# EAGLE design autopilot (EAGLE 9.6.2)
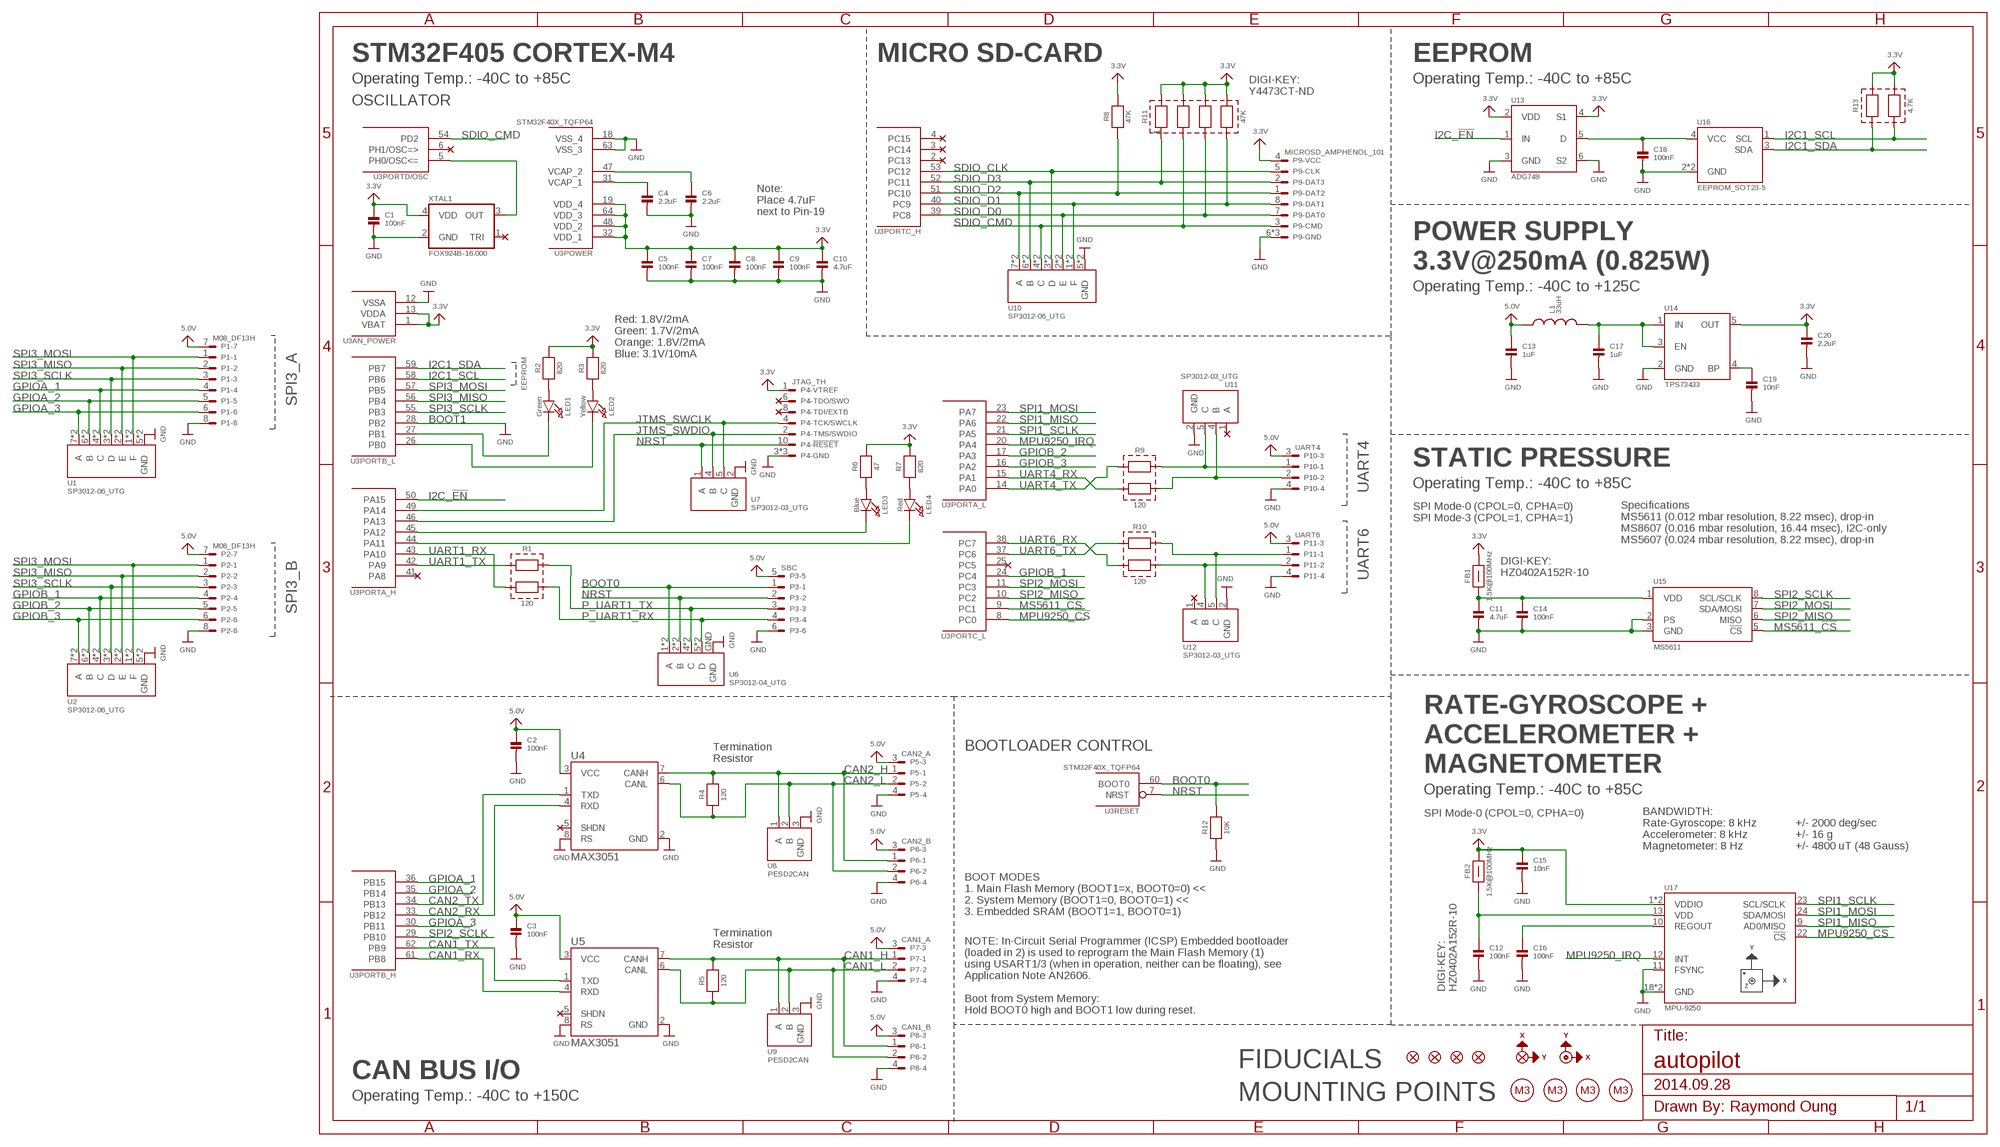
[diagram p0: schematic, sheet 1]

## Parts
AXIS3D1  AXIS3D_DOWN  [AXIS3D_DOWN]
AXIS3D2  AXIS3D_UP  [AXIS3D_UP]
C1  100nF  CAP_CERAMIC0402  [0402]
C2  100nF  CAP_CERAMIC0402  [0402]
C3  100nF  CAP_CERAMIC0402  [0402]
C4  2.2uF  CAP_CERAMIC0402  [0402]
C5  100nF  CAP_CERAMIC0402  [0402]
C6  2.2uF  CAP_CERAMIC0402  [0402]
C7  100nF  CAP_CERAMIC0402  [0402]
C8  100nF  CAP_CERAMIC0402  [0402]
C9  100nF  CAP_CERAMIC0402  [0402]
C10  4.7uF  CAP_CERAMIC0402  [0402]
C11  4.7uF  CAP_CERAMIC0402  [0402]
C12  100nF  CAP_CERAMIC0402  [0402]
C13  1uF  CAP_CERAMIC0402  [0402]
C14  100nF  CAP_CERAMIC0402  [0402]
C15  10nF  CAP_CERAMIC0402  [0402]
C16  100nF  CAP_CERAMIC0402  [0402]
C17  1uF  CAP_CERAMIC0402  [0402]
C18  100nF  CAP_CERAMIC0402  [0402]
C19  10nF  CAP_CERAMIC0402  [0402]
C20  2.2uF  CAP_CERAMIC0402  [0402]
FB1  1.5K@100MHz  FERRITE_0402  [0402]
FB2  1.5K@100MHz  FERRITE_0402  [0402]
L1  33uH  INDUCTOR_1210  [1210]
LED1  Green  LED_0603  [CHIPLED_0603]
LED2  Yellow  LED_0603  [CHIPLED_0603]
LED3  Blue  LED_0603  [CHIPLED_0603]
LED4  Red  LED_0603  [CHIPLED_0603]
MP1  M3  [MP_M3]
MP2  M3  [MP_M3]
MP3  M3  [MP_M3]
MP4  M3  [MP_M3]
P1  M08_DF13H  [DF13A-8P-1.25H]
P2  M08_DF13H  [DF13A-8P-1.25H]
P3  SBC  M06_DF13H  [DF13A-6P-1.25H]
P4  JTAG_TH  [FTSH-105-01-XXX-DV]
P5  CAN2_A  M04_DF13H  [DF13A-4P-1.25H]
P6  CAN2_B  M04_DF13H  [DF13A-4P-1.25H]
P7  CAN1_A  M04_DF13H  [DF13A-4P-1.25H]
P8  CAN1_B  M04_DF13H  [DF13A-4P-1.25H]
P9  MICROSD_AMPHENOL_101  [AMPHENOL_101-00660-68]
P10  UART4  M04_DF13H  [DF13A-4P-1.25H]
P11  UART6  M04_DF13H  [DF13A-4P-1.25H]
R1  120  RESISTOR2_0603X2  [EXBV4V]
R2  820  RESISTOR0402  [0402]
R3  820  RESISTOR0402  [0402]
R4  120  RESISTOR0603  [0603]
R5  120  RESISTOR0603  [0603]
R6  47  RESISTOR0402  [0402]
R7  820  RESISTOR0402  [0402]
R8  47K  RESISTOR0603  [0603]
R9  120  RESISTOR2_0603X2  [EXBV4V]
R10  120  RESISTOR2_0603X2  [EXBV4V]
R11  47K  RESISTOR4_0603X4  [EXBV8V]
R12  10K  RESISTOR0402  [0402]
R13  4.7K  RESISTOR2_0603X2  [EXBV4V]
REF1  FIDUCIAL1X2.5  [POINT-1MM]
REF2  FIDUCIAL1X2.5  [POINT-1MM]
REF3  FIDUCIAL1X2.5  [POINT-1MM]
REF4  FIDUCIAL1X2.5  [POINT-1MM]
U1  SP3012-06_UTG  [UDFN14]
U2  SP3012-06_UTG  [UDFN14]
U3  STM32F40X_TQFP64  [TQFP64]
U4  MAX3051  [SOT23-8]
U5  MAX3051  [SOT23-8]
U6  SP3012-04_UTG  [UDFN10]
U7  SP3012-03_UTG  [UDFN06]
U8  PESD2CAN  [SOT23-3]
U9  PESD2CAN  [SOT23-3]
U10  SP3012-06_UTG  [UDFN14]
U11  SP3012-03_UTG  [UDFN06]
U12  SP3012-03_UTG  [UDFN06]
U13  ADG749  [SOT-363]
U14  TPS73433  [SOT23-5]
U15  MS5611  [MS5611]
U16  EEPROM_SOT23-5  [SOT23-5]
U17  MPU-9250  [MPU-3X3]
XTAL1  FOX924B-16.000  TCXO_5.0X3.2A  [OSCILLATOR-5.0X3.2A]

## Nets
3.3V [PWR]: C1.1 C5.1 C7.1 C8.1 C9.1 C10.1 C15.1 C20.1 FB1.2 FB2.2 P4.1 P9.4 R2.2 R3.2 R6.2 R7.2 R8.2 R11.5 R11.6 R11.7 R11.8 R13.3 R13.4 U3.1(AN_POWER:VBAT) U3.13(AN_POWER:VDDA) U3.19(POWER:VDD_4) U3.32(POWER:VDD_1) U3.48(POWER:VDD_2) U3.64(POWER:VDD_3) U13.2(VDD) U13.4(S1) U14.5(OUT) U17.1(VDDIO) U17.8(VDDIO) XTAL1.4(VDD)
5.0V [PWR]: C2.1 C3.1 C13.1 L1.1 P1.7 P2.7 P3.5 P5.3 P6.3 P7.3 P8.3 P10.3 P11.3 U4.3(VCC) U5.3(VCC)
BOOT0 [PWR]: P3.1 R12.2 U3.60(RESET:BOOT0) U6.1(A) U6.10(A)
CAN1_H: P7.1 P8.1 R5.2 U5.7(CANH) U9.1(A)
CAN1_L: P7.2 P8.2 R5.1 U5.6(CANL) U9.2(B)
CAN1_RX: U3.61(PORTB_H:PB8) U5.4(RXD)
CAN1_TX: U3.62(PORTB_H:PB9) U5.1(TXD)
CAN2_H: P5.1 P6.1 R4.2 U4.7(CANH) U8.1(A)
CAN2_L: P5.2 P6.2 R4.1 U4.6(CANL) U8.2(B)
CAN2_RX: U3.33(PORTB_H:PB12) U4.4(RXD)
CAN2_TX: U3.34(PORTB_H:PB13) U4.1(TXD)
GND [PWR]: C1.2 C2.2 C3.2 C4.2 C5.2 C6.2 C7.2 C8.2 C9.2 C10.2 C11.2 C12.2 C13.2 C14.2 C15.2 C16.2 C17.2 C18.2 C19.2 C20.2 P1.8 P2.8 P3.6 P4.3 P4.5 P4.9 P5.4 P6.4 P7.4 P8.4 P9.6 P9.GND1 P9.GND3 P10.4 P11.4 R12.1 U1.5(GND) U1.10(GND) U2.5(GND) U2.10(GND) U3.12(AN_POWER:VSSA) U3.18(POWER:VSS_4) U3.28(PORTB_L:PB2) U3.63(POWER:VSS_3) U4.2(GND) U4.8(RS) U5.2(GND) U5.8(RS) U6.GND U7.2(GND) U8.3(GND) U9.3(GND) U10.5(GND) U10.10(GND) U11.2(GND) U12.2(GND) U13.3(GND) U13.6(S2) U14.2(GND) U15.2(PS) U15.3(GND) U16.2(GND) U16.5(GND) U17.11(FSYNC) U17.18(GND) U17.20(GND) XTAL1.2(GND)
GPIOA_1: P1.4 U1.4(C) U1.11(C) U3.36(PORTB_H:PB15)
GPIOA_2: P1.5 U1.6(B) U1.9(B) U3.35(PORTB_H:PB14)
GPIOA_3: P1.6 U1.7(A) U1.8(A) U3.30(PORTB_H:PB11)
GPIOB_1: P2.4 U2.4(C) U2.11(C) U3.24(PORTC_L:PC4)
GPIOB_2: P2.5 U2.6(B) U2.9(B) U3.17(PORTA_L:PA3)
GPIOB_3: P2.6 U2.7(A) U2.8(A) U3.16(PORTA_L:PA2)
I2C1_SCL: R13.2 U3.58(PORTB_L:PB6) U16.1(SCL)
I2C1_SDA: R13.1 U3.59(PORTB_L:PB7) U16.3(SDA)
I2C_!EN: U3.50(PORTA_H:PA15) U13.1(IN)
JTMS_SWCLK: P4.4 U3.49(PORTA_H:PA14) U7.5(C)
JTMS_SWDIO: P4.2 U3.46(PORTA_H:PA13) U7.4(B)
MPU9250_!CS: U3.8(PORTC_L:PC0) U17.22(!CS)
MPU9250_IRQ: U3.20(PORTA_L:PA4) U17.12(INT)
MS5611_!CS: U3.9(PORTC_L:PC1) U15.5(!CS)
N$1: LED4.A R7.1
N$2: LED1.A R2.1
N$3: LED2.A R3.1
N$4: C16.1 U17.10(REGOUT)
N$5: LED3.A R6.1
N$6: C12.1 FB2.1 U17.13(VDD)
N$7: LED3.C U3.45(PORTA_H:PA12)
N$8: U3.5(PORTD/OSC:PH0/OSC<=) XTAL1.3(OUT)
N$9 [PWR]: C18.1 U13.5(D) U16.4(VCC)
N$11: C19.1 U14.4(BP)
N$12: LED4.C U3.44(PORTA_H:PA11)
N$13: LED1.C U3.27(PORTB_L:PB1)
N$14: LED2.C U3.26(PORTB_L:PB0)
N$18: C17.1 L1.2 U14.1(IN) U14.3(EN)
NRST: P3.2 P4.10 U3.7(RESET:NRST) U6.2(B) U6.9(B) U7.1(A)
P_UART1_RX: P3.4 R1.3 U6.5(D) U6.6(D)
P_UART1_TX: P3.3 R1.4 U6.4(C) U6.7(C)
P_UART4_RX: P10.2 R9.3 U11.4(B)
P_UART4_TX: P10.1 R9.4 U11.5(C)
P_UART6_RX: P11.2 R10.3 U12.4(B)
P_UART6_TX: P11.1 R10.4 U12.5(C)
SDIO_CLK: P9.5 U3.53(PORTC_H:PC12) U10.3(D) U10.12(D)
SDIO_CMD: P9.3 R11.2 U3.54(PORTD/OSC:PD2) U10.4(C) U10.11(C)
SDIO_D0: P9.7 R11.3 U3.39(PORTC_H:PC8) U10.2(E) U10.13(E)
SDIO_D1: P9.8 R11.4 U3.40(PORTC_H:PC9) U10.1(F) U10.14(F)
SDIO_D2: P9.1 R8.1 U3.51(PORTC_H:PC10) U10.7(A) U10.8(A)
SDIO_D3: P9.2 R11.1 U3.52(PORTC_H:PC11) U10.6(B) U10.9(B)
SPI1_MISO: U3.22(PORTA_L:PA6) U17.9(AD0/MISO)
SPI1_MOSI: U3.23(PORTA_L:PA7) U17.24(SDA/MOSI)
SPI1_SCLK: U3.21(PORTA_L:PA5) U17.23(SCL/SCLK)
SPI2_MISO: U3.10(PORTC_L:PC2) U15.6(MISO)
SPI2_MOSI: U3.11(PORTC_L:PC3) U15.7(SDA/MOSI)
SPI2_SCLK: U3.29(PORTB_H:PB10) U15.8(SCL/SCLK)
SPI3_MISO: P1.2 P2.2 U1.2(E) U1.13(E) U2.2(E) U2.13(E) U3.56(PORTB_L:PB4)
SPI3_MOSI: P1.1 P2.1 U1.1(F) U1.14(F) U2.1(F) U2.14(F) U3.57(PORTB_L:PB5)
SPI3_SCLK: P1.3 P2.3 U1.3(D) U1.12(D) U2.3(D) U2.12(D) U3.55(PORTB_L:PB3)
UART1_RX: R1.2 U3.43(PORTA_H:PA10)
UART1_TX: R1.1 U3.42(PORTA_H:PA9)
UART4_RX: R9.2 U3.15(PORTA_L:PA1)
UART4_TX: R9.1 U3.14(PORTA_L:PA0)
UART6_RX: R10.2 U3.38(PORTC_L:PC7)
UART6_TX: R10.1 U3.37(PORTC_L:PC6)
VCAP_1 [PWR]: C4.1 U3.31(POWER:VCAP_1)
VCAP_2 [PWR]: C6.1 U3.47(POWER:VCAP_2)
VDD_PRES: C11.1 C14.1 FB1.1 U15.1(VDD)
Unconnected: P4.6 P4.8 U3.2(PORTC_H:PC13) U3.3(PORTC_H:PC14) U3.4(PORTC_H:PC15) U3.6(PORTD/OSC:PH1/OSC=>) U3.25(PORTC_L:PC5) U3.41(PORTA_H:PA8) U4.5(SHDN) U5.5(SHDN) U11.1(A) U12.1(A) XTAL1.1(TRI)

## Notes on the sheet
- STM32F405 CORTEX-M4 | MICRO SD-CARD | EEPROM
- Operating Temp.: -40C to +85C | Operating Temp.: -40C to +85C
- DIGI-KEY:
  Y4473CT-ND
- OSCILLATOR
- Note: 
  Place 4.7uF 
  next to Pin-19
- POWER SUPPLY
  3.3V@250mA (0.825W)
- Operating Temp.: -40C to +125C
- Red: 1.8V/2mA
  Green: 1.7V/2mA
  Orange: 1.8V/2mA
  Blue: 3.1V/10mA
- EEPROM
- SPI3_A
- BOOT1
- UART4 | STATIC PRESSURE
- Operating Temp.: -40C to +85C
- SPI Mode-0 (CPOL=0, CPHA=0)
  SPI Mode-3 (CPOL=1, CPHA=1)
- Specifications
  MS5611 (0.012 mbar resolution, 8.22 msec), drop-in
  MS8607 (0.016 mbar resolution, 16.44 msec), I2C-only
  MS5607 (0.024 mbar resolution, 8.22 msec), drop-in
- UART6
- DIGI-KEY: 
  HZ0402A152R-10
- SPI3_B
- BOOTLOADER CONTROL
- Termination
  Resistor
- RATE-GYROSCOPE + 
  ACCELEROMETER + 
  MAGNETOMETER
- Operating Temp.: -40C to +85C
- SPI Mode-0 (CPOL=0, CPHA=0)
- BANDWIDTH:
  Rate-Gyroscope: 8 kHz
  Accelerometer: 8 kHz
  Magnetometer: 8 Hz
- +/- 2000 deg/sec
  +/- 16 g
  +/- 4800 uT (48 Gauss)
- BOOT MODES
  1. Main Flash Memory (BOOT1=x, BOOT0=0) <<
  2. System Memory (BOOT1=0, BOOT0=1) <<
  3. Embedded SRAM (BOOT1=1, BOOT0=1)
- Termination
  Resistor
- DIGI-KEY: 
  HZ0402A152R-10
- NOTE: In-Circuit Serial Programmer (ICSP) Embedded bootloader
  (loaded in 2) is used to reprogram the Main Flash Memory (1) 
  using USART1/3 (when in operation, neither can be floating), see
  Application Note AN2606.
  
  Boot from System Memory:
  Hold BOOT0 high and BOOT1 low during reset.
- FIDUCIALS
- CAN BUS I/O
- 2014.09.28
- Operating Temp.: -40C to +150C | MOUNTING POINTS

## Library data of the parts
AXIS3D1 = custom-artwork:AXIS3D_DOWN
AXIS3D2 = custom-artwork:AXIS3D_UP: 3D Axes
C1-C20 = custom-generic:CAP_CERAMIC: Ceramic Capacitor 0402 - 0402 Surface Mount Capacitors 16pF 50V 5% [Digikey: 445-4899-2-ND] 18pF 50V 5% [Digikey: 490-1281-2-ND] 22pF 50V 5% [Digikey: 490-1283-2-ND] 68pF 50V 5% [Digikey: 490-1289-2-ND] 0.1uF 10V 10% [Digikey: 490-1318-2-ND] 1.0uF 6.3V 10% [Digikey: 490-1320-2-ND] 0603 - 0603 Surface Mount Capacitors 16 pF 50V 5% [Digikey: 445-5051-2-ND] 22 pF 50V [Digikey: PCC220ACVTR-ND] 33 pF 50V 5% [Digikey: 490-1415-1-ND] 56pF 50V 5% [Digikey: 490-1421-1-ND] 220pF 50V 5% [Digikey: 445-1285-1-ND] 680 pF 50V 2200 pF 50V 5% C0G [Digikey: 445-1297-1-ND] 5600 pF 100V 5% X7R [Digikey: 478-3711-1-ND] 0.1 µF 25V 10% [Digikey: PCC2277TR-ND] 0.22 µF 16V 10% X7R [Digikey: 445-1318-1-ND] 1.0 µF 25V 10% [Digikey: 445-5146-2-ND] 0603 - RF Specific 3pF 250V +/-0.1pF RF [Digikey: 712-1347-1-ND] 18 pF 250V 5% [Digikey: 478-3505-1-ND or 712-1322-1-ND] 56 pF 250V 5% C0G RF [Digikey: 490-4867-1-ND] 68 pF 250V RF [Digikey: 490-4868-1-ND] 0805 - 0805 Surface Mount Capacitors 220 pF 250V 2% RF Ceramic Capacitor [Digikey: 712-1398-1-ND] 1000 pF 50V 2% NP0 Ceramic Capacitor [Digikey: 478-3760-1-ND] 0.1 µF 25V 10% Ceramic Capacitor [Digikey: PCC1828TR-ND] 1.0 µF 16V 10% Ceramic Capacitor[Digikey: 490-1691-2-ND] 10.0 µF 10V 10% Ceramic Capacitor[Digikey: 709-1228-1-ND] 10.0 uF 16V 10% Ceramic Capacitor [Digikey: 478-5165-2-ND] 47 uF 6.3V 20% Ceramic Capacitor [Digikey: 587-1779-1-ND or 399-5506-1-ND] 1206 - 1206 Surface Mount Capacitors 47uF 10V 20% Ceramic Capacitor [Digikey: 490-5528-1-ND or 399-5508-1-ND or 445-6010-1-ND]
FB1 FB2 = custom-generic:FERRITE: Ferrite Bead
L1 = custom-generic:INDUCTOR: Inductors Basic Inductor/Choke - 0603 and 1206. Footprints are not proven and vary greatly between part numbers.
LED1-LED4 = custom-generic:LED: LED 0603 - 0603 Surface Mount Package 2mA: Blue LED - Low Power (39.2mcd, 10 mA, 3.1Vf) - DigiKey: 475-1383-1-ND Green LED - Low Power (3.9mcd, 2mA, 1.7Vf) - Digikey: 475-2709-1-ND Orange LED - Low Power (9.8mcd, 2mA, 1.8Vf) - Digikey: 475-1194-2-ND Red LED - Low Power (5mcd, 2mA, 1.8Vf) - Digikey: 475-2506-1-ND Yellow LED - Low Power (7mcd, 2mA, 1.8Vf) - Digikey: 475-1196-1-ND 5mA: Blue LED - Low Power (17mcd, 5ma, 2.9Vf) - Digikey: LNJ937W8CRACT-ND 0805 - 0805 Surface Mount Package 2mA: Red LED (8.8mcd, 2mA, 1.8Vf, Clear) - Low Power [Digikey: 475-2510-1-ND] Green LED (5mcd, 2mA, 1.8Vf, Clear) - Low Power [Digikey: 475-2730-1-ND] Yellow LED (11.3mcd, 2mA, 1.8Vf, Clear) - Low Power [Digikey: 475-2555-1-ND] 20mA: Red LED (104mcd, 20mA, Diffused) - LS R976 [Digikey: 475-1278-6-ND] Red LED (12mcd, 20mA, 2.0Vf, Clear) - APT2012EC [Digikey: 754-1128-1-ND] Green LED (15mcd, 20mA, 2.2Vf, Clear) - APT2012GC [Digikey: 754-1131-1-ND] Orange LED (160mcd, 20mA, 2.1Vf, Clear) - APT2012SECK [Digikey: 754-1130-1-ND] 1206 - 1206 Surface Mount Package Green LED (26mcd, 20mA, Diffused) - LG N971 [Digikey: 475-1407-6-ND] Red LED (15mcd, 20mA, Diffused) - LH N974 [Digikey: 475-1416-6-ND]
MP1-MP4 = custom-mechanical:M3: Mounting Point M3
P1 P2 = custom-connectors:M08: 8-Way Connector; DIGI-KEY: H3386-ND
P3 = custom-connectors:M06: 6-Way Connector; DIGI-KEY: H3371-ND; MOUSER: 798-DF13A6P125H20
P4 = custom-connectors:JTAG: JTAG Connector; DIGI-KEY: 952-1383-ND; MOUSER: 855-M50-3500542; TEMPERATURE: -40°C to 105°C
P5-P8 P10 P11 = custom-connectors:M04: 4-Way Connector; DIGI-KEY: H3369-ND; MOUSER: 798-DF13A4P125H20; TEMPERATURE: -35°C to +85°C
P9 = custom-connectors:MICROSD: SD Card; DIGI-KEY: 101-00660-68-6-1-ND; MOUSER: 523-101-00660-68-6
R1 R9 R10 R13 = custom-generic:RESISTOR2: 2x Isolated Resistor Network
R2-R8 R12 = custom-generic:RESISTOR: Resistors 0402 - 0402 Surface Mount Package 22 Ohm 1% 1/16W [Digikey: 311-22.0LRTR-ND] 33 Ohm 5% 1/16W 1.0K 5% 1/16W 1.5K 5% 1/16W 2.0K 1% 1/16W 10.0K 1% 1/16W [Digikey: 311-10.0KLRTR-ND] 10.0K 5% 1/16W [Digikey: RMCF0402JT10K0TR-ND] 12.1K 1% 1/16W [Digikey: 311-22.0LRTR-ND] 100.0K 5% 1/16W 0603 - 0603 Surface Mount Package 0 Ohm 1/10 Watt 1% Resistor 15 Ohm 1/10 Watt 1% Resistor 33 Ohm 1/10 Watt 1% Resistor 49.9 Ohm 1/10 Watt 1% Resistor 100 Ohm 1/10 Watt 1% Resistor 150 Ohm 1/10 Watt 1% Resistor 240 Ohm 1/10 Watt 1% Resistor 390 Ohm 1/10 Watt 1% Resistor 560 Ohm 1/10 Watt 1% Resistor 680 Ohm 1/10 Watt 1% Resistor 750 Ohm 1/10 Watt 1% Resistor 1.0K Ohm 1/10 Watt 1% Resistor 1.5K Ohm 1/10 Watt 1% Resistor 2.0K Ohm 1/10 Watt 1% Resistor 2.2K Ohm 1/10 Watt 1% Resistor 3.3K Ohm 1/10 Watt 1% Resistor 4.7K Ohm 1/10 Watt 1% Resistor 10.0K Ohm 1/10 Watt 1% Resistor 12.0K Ohm 1/10 Watt 1% Resistor 12.1K Ohm 1/10 Watt 1% Resistor 20.0K Ohm 1/10 Watt 1% Resistor 33.0K Ohm 1/10 Watt 1% Resistor 100.0K Ohm 1/10 Watt 1% Resistor 0805 - 0805 Surface Mount Package 0 Ohm 1/8 Watt 1% Resistor 33 Ohm 1/8 Watt 1% Resistor 100 Ohm 1/8 Watt 1% Resistor 150 Ohm 1/8 Watt 1% Resistor 200 Ohm 1/8 Watt 1% Resistor 240 Ohm 1/8 Watt 1% Resistor 330 Ohm 1/8 Watt 1% Resistor 390 Ohm 1/8 Watt 1% Resistor 470 Ohm 1/8 Watt 1% Resistor 1.0K Ohm 1/8 Watt 1% Resistor 1.5K Ohm 1/8 Watt 1% Resistor 2.0K Ohm 1/8 Watt 1% Resistor 4.7K Ohm 1/8 Watt 1% Resistor 5.1K Ohm 1/8 Watt 1% Resistor 5.6K Ohm 1/8 Watt 1% Resistor 10.0K Ohm 1/8 Watt 1% Resistor 22.0K Ohm 1/8 Watt 1% Resistor 33.0K Ohm 1/8 Watt 1% Resistor 100K Ohm 1/8 Watt 1% Resistor 1206 - 1206 Surface Mount Package 2012 - 2010 Surface Mount Package 0.11 Ohm 1/2 Watt 1% Resistor - Digikey: RHM.11UCT-ND
R11 = custom-generic:RESISTOR4: 4x Isolated Resistor Network
REF1-REF4 = custom-mechanical:FIDUCIAL: Fiducial Alignment Points Various fiducial points for machine vision alignment.
U1 U2 U10 = custom-devices:SP3012-06: TVS Diode Arrays 6-Ch 12KV 0.5pF; DIGI-KEY: F5914CT-ND; MOUSER: 576-SP3012-06UTG
U3 = custom-devices:STM32F40X_TQFP64: STM32F40x 64-pin LQFP; DIGI-KEY: 497-11767-ND; MOUSER: 511-STM32F405RGT6
U4 U5 = custom-devices:MAX3051: CAN Transceiver; DIGI-KEY: MAX3051EKA+TCT-ND; MOUSER: 700-MAX3051EKAT
U6 = custom-devices:SP3012-04: TVS Diode Arrays 4-Ch 12KV 0.5pF; DIGI-KEY: F4087CT-ND; MOUSER: 576-SP3012-04UTG
U7 U11 U12 = custom-devices:SP3012-03: TVS Diode Arrays 3-Ch 12KV 0.5pF; DIGI-KEY: F6292CT-ND; MOUSER: 576-SP3012-03UTG
U8 U9 = custom-devices:PESD2CAN: PESD2CAN in a small SOT23 Surface-Mounted Device (SMD) plastic package designed to protect two automotive Controller Area Network (CAN) bus lines from the damage caused by ElectroStatic Discharge (ESD) and other transients.; DIGI-KEY: 568-4147-1-ND; MOUSER: 771-PESD2CAN-T/R
U13 = custom-devices:ADG749: 2:1 Multiplexer; DIGI-KEY: ADG749BKSZ-REEL7CT-ND; MOUSER: 584-ADG749BKSZ-R7
U14 = custom-devices:TPS73433: 3.3V, 250mA, Low Quiescent Current, Ultra-Low Noise, High PSRR Low-Dropout Linear Regulator.; DIGI-KEY: 296-36844-1-ND; MOUSER: 595-TPS73433TDDCRQ1
U15 = custom-devices:MS5611: Pressure Sensor; FARNELL: 2362662; MOUSER: 824-MS561101BA03-50
U16 = custom-devices:EEPROM: I2C EEPROM 64Kbytes; DIGI-KEY: 24LC64T-I/OTCT-ND; MOUSER: 579-24LC64T-I/OT
U17 = custom-devices:MPU-9250: Nine-Axis (Gyro + Accelerometer + Compass) MEMS MotionTracking™ Device; DIGI-KEY: 1428-1019-1-ND
XTAL1 = custom-generic:TCXO: Temperature Compensated Crystal Oscillator

## Net classes
0 default: width 0.152 mm, drill 0.203 mm, clearance 0.152 mm
1 PWR: width 0.203 mm, drill 0.203 mm, clearance 0.152 mm

## Board
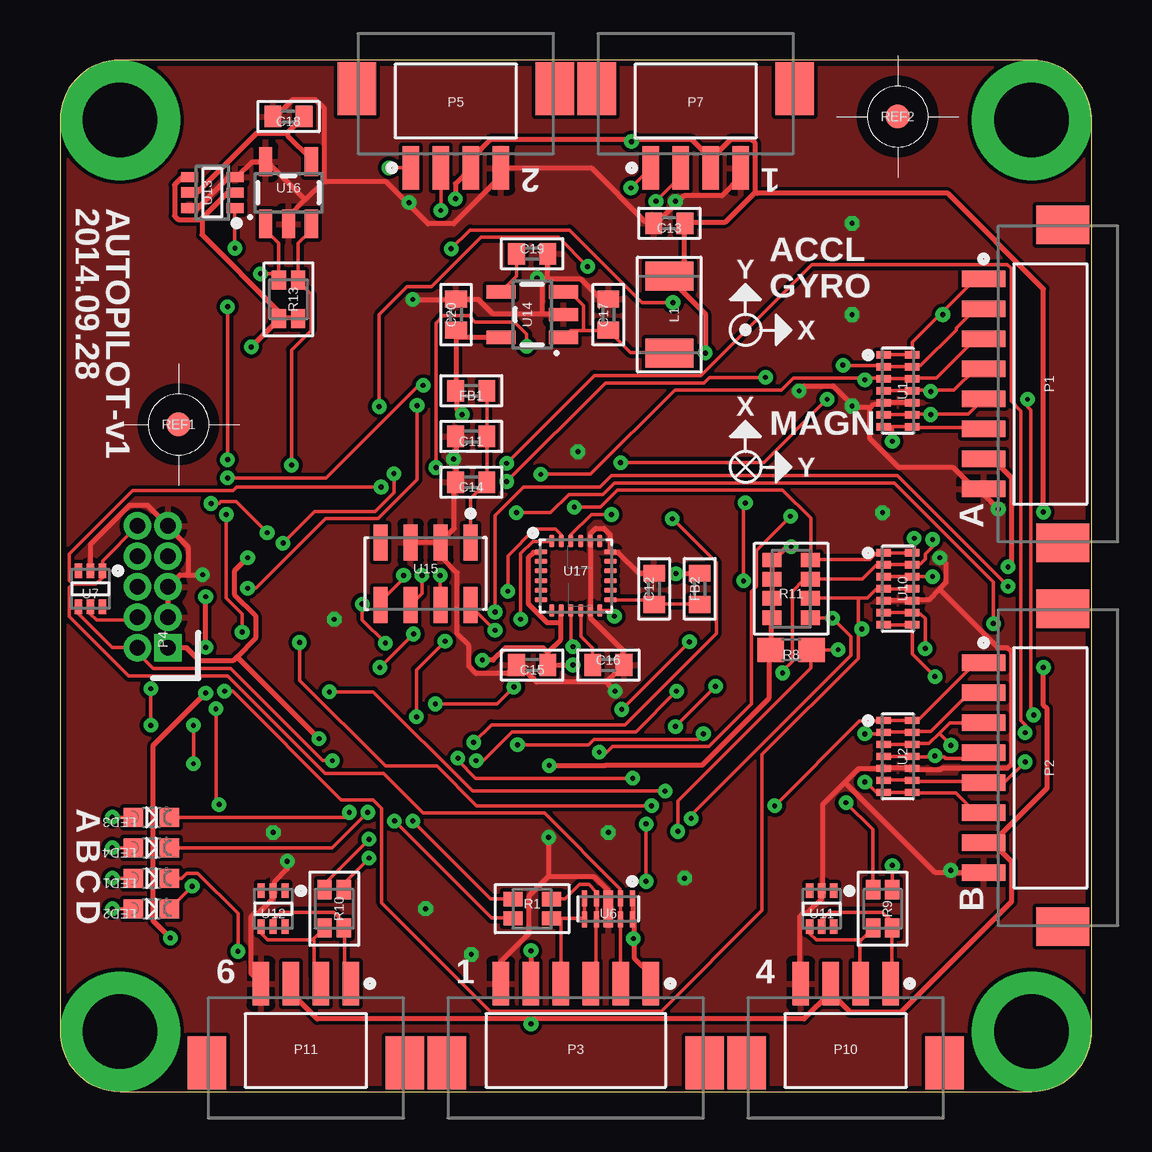
[diagram p1: board, top side]
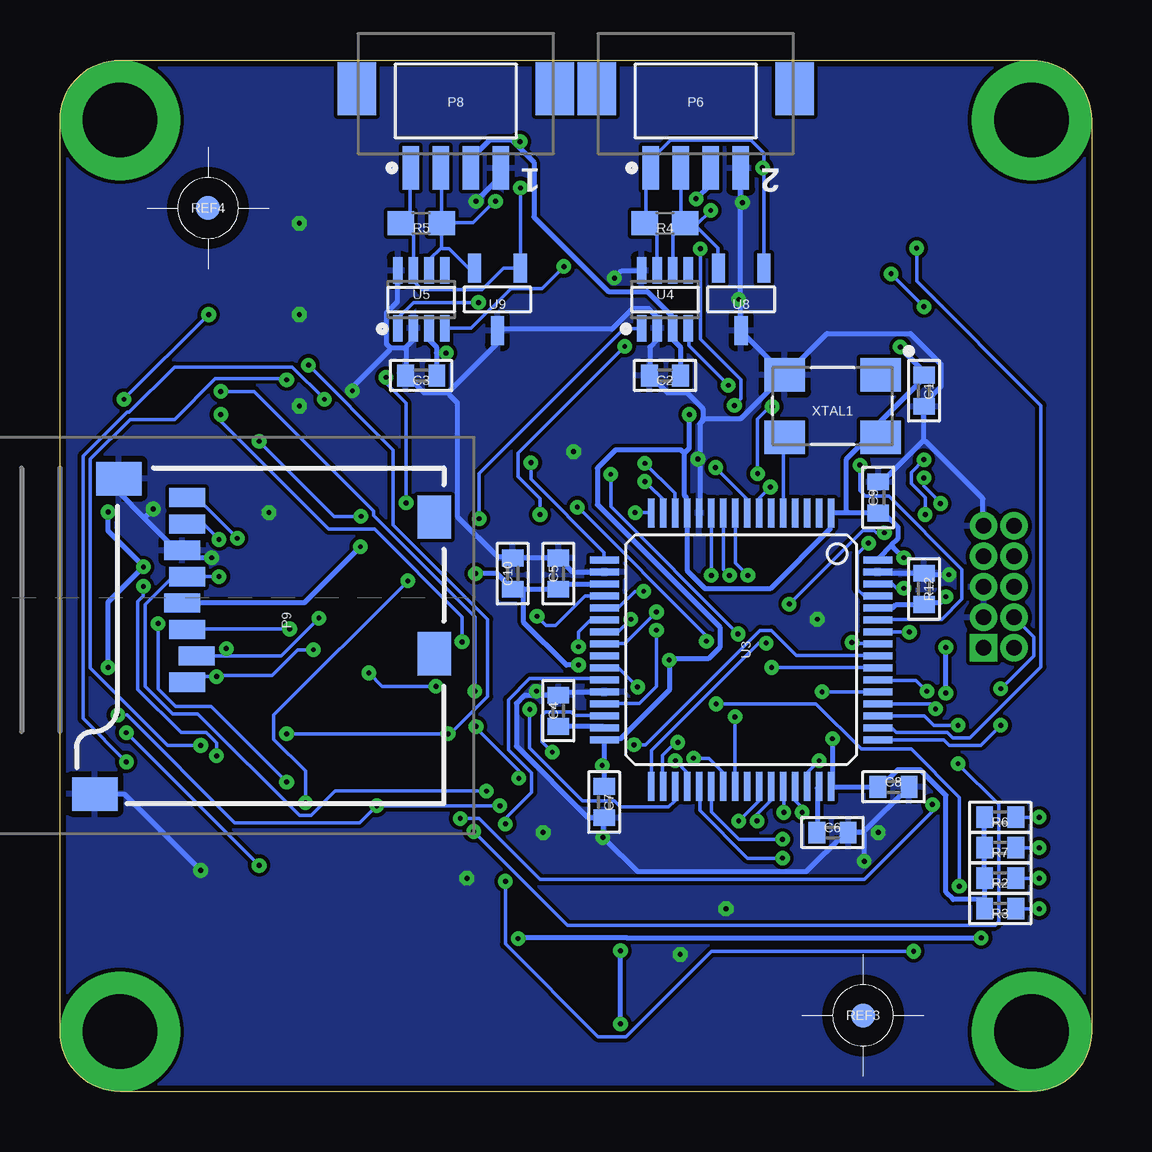
[diagram p2: board, bottom side, seen from below]

Size 43 x 43 mm. Coordinates in mm from the lower left corner, seen from the top.
Outline: 2.5,0 40.5,0 arc90 43,2.5 43,40.5 arc90 40.5,43 2.5,43 arc90 0,40.5 0,2.5 arc90 2.5,0
Copper layers (1*16): Top 0.035mm / dielectric 1.5mm / Bottom 0.035mm
Design rules "BetaLayout-2layer": minimum track width 6mil, minimum drill 8mil, track to track 6mil, track to pad 6mil, pad to pad 6mil, via to via 6mil, smd to smd 0mil, copper to edge 10mil, drill to drill 10mil, minimum pad ring 10mil, minimum via ring 8mil, stop-mask expansion 2mil, vias tented up to drill 100mil, thermal gap 10mil

### Footprints (pad centres in the part's own frame; a part is rotated, then mirrored left to right if it is on the bottom)
0402 = smd 0.7 x 0.9: 1 -0.65,0; 2 0.65,0
1210 = smd 1.2 x 2: 1 -1.6,0; 2 1.6,0
CHIPLED_0603 = smd 0.8 x 0.8: A 0,-0.75; C 0,0.75
MP_M3 = drill 3.1 pad 5: NC 0,0
DF13A-8P-1.25H = smd 0.7 x 1.8: 1 -4.375,0; 2 -3.125,0; 3 -1.875,0; 4 -0.625,0; 5 0.625,0; 6 1.875,0; 7 3.125,0; 8 4.375,0 | smd 1.6 x 2.2: NC1 -6.625,3.3; NC2 6.625,3.3
DF13A-6P-1.25H = smd 0.7 x 1.8: 1 -3.125,0; 2 -1.875,0; 3 -0.625,0; 4 0.625,0; 5 1.875,0; 6 3.125,0 | smd 1.6 x 2.2: NC1 -5.375,3.3; NC2 5.375,3.3
FTSH-105-01-XXX-DV = drill 0.65 pad 1 square: 1 0,0 | drill 0.65 pad 1: 2 0,1.27; 3 1.27,0; 4 1.27,1.27; 5 2.54,0; 6 2.54,1.27; 7 3.81,0; 8 3.81,1.27; 9 5.08,0; 10 5.08,1.27
DF13A-4P-1.25H = smd 0.7 x 1.8: 1 -1.875,0; 2 -0.625,0; 3 0.625,0; 4 1.875,0 | smd 1.6 x 2.2: NC1 -4.125,3.3; NC2 4.125,3.3
AMPHENOL_101-00660-68 = smd 0.8 x 1.5: 1 -8.94,10.7; 2 -7.84,10.3; 3 -6.74,10.7; 4 -5.64,10.9; 5 -4.54,10.7; 6 -3.44,10.9; 7 -2.34,10.7; 8 -1.24,10.7 | smd 1.8 x 1.4: CD1 -2.05,0.4; CD2 -7.75,0.4 | smd 1.4 x 1.9: GND1 -13.6,14.55; GND3 -0.45,13.55
EXBV4V = smd 0.8 x 0.6: 1 -0.8,0.4; 2 -0.8,-0.4; 3 0.8,-0.4; 4 0.8,0.4
0603 = smd 1.1 x 1: 1 -0.85,0; 2 0.85,0
EXBV8V = smd 0.8 x 0.6: 1 -0.8,1.2; 2 -0.8,0.4; 3 -0.8,-0.4; 4 -0.8,-1.2; 5 0.8,-1.2; 6 0.8,-0.4; 7 0.8,0.4; 8 0.8,1.2
POINT-1MM = smd 1 x 1: 1 0,0
UDFN14 = smd 0.3 x 0.6: 1 -1.5,-0.6; 2 -1,-0.6; 3 -0.5,-0.6; 4 0,-0.6; 5 0.5,-0.6; 6 1,-0.6; 7 1.5,-0.6; 8 1.5,0.6; 9 1,0.6; 10 0.5,0.6; 11 0,0.6; 12 -0.5,0.6; 13 -1,0.6; 14 -1.5,0.6
TQFP64 = smd 1.2 x 0.29: 1 -5.7,3.75; 2 -5.7,3.25; 3 -5.7,2.75; 4 -5.7,2.25; 5 -5.7,1.75; 6 -5.7,1.25; 7 -5.7,0.75; 8 -5.7,0.25; 9 -5.7,-0.25; 10 -5.7,-0.75; 11 -5.7,-1.25; 12 -5.7,-1.75; 13 -5.7,-2.25; 14 -5.7,-2.75; 15 -5.7,-3.25; 16 -5.7,-3.75; 33 5.7,-3.75; 34 5.7,-3.25; 35 5.7,-2.75; 36 5.7,-2.25; 37 5.7,-1.75; 38 5.7,-1.25; 39 5.7,-0.75; 40 5.7,-0.25; 41 5.7,0.25; 42 5.7,0.75; 43 5.7,1.25; 44 5.7,1.75; 45 5.7,2.25; 46 5.7,2.75; 47 5.7,3.25; 48 5.7,3.75 | smd 0.29 x 1.2: 17 -3.75,-5.7; 18 -3.25,-5.7; 19 -2.75,-5.7; 20 -2.25,-5.7; 21 -1.75,-5.7; 22 -1.25,-5.7; 23 -0.75,-5.7; 24 -0.25,-5.7; 25 0.25,-5.7; 26 0.75,-5.7; 27 1.25,-5.7; 28 1.75,-5.7; 29 2.25,-5.7; 30 2.75,-5.7; 31 3.25,-5.7; 32 3.75,-5.7; 49 3.75,5.7; 50 3.25,5.7; 51 2.75,5.7; 52 2.25,5.7; 53 1.75,5.7; 54 1.25,5.7; 55 0.75,5.7; 56 0.25,5.7; 57 -0.25,5.7; 58 -0.75,5.7; 59 -1.25,5.7; 60 -1.75,5.7; 61 -2.25,5.7; 62 -2.75,5.7; 63 -3.25,5.7; 64 -3.75,5.7
SOT23-8 = smd 0.4 x 1.1: 1 -0.975,-1.204; 2 -0.325,-1.204; 3 0.325,-1.204; 4 0.975,-1.204; 5 0.975,1.204; 6 0.325,1.204; 7 -0.325,1.204; 8 -0.975,1.204
UDFN10 = smd 0.2 x 0.675: 1 -1,-0.438; 2 -0.5,-0.438; 4 0.5,-0.438; 5 1,-0.438; 6 1,0.438; 7 0.5,0.438; 9 -0.5,0.438; 10 -1,0.438 | smd 0.4 x 1.55: GND 0,0
UDFN06 = smd 0.3 x 0.6: 1 -0.5,-0.75; 2 0,-0.75; 3 0.5,-0.75; 4 0.5,0.75; 5 0,0.75; 6 -0.5,0.75
SOT23-3 = smd 0.55 x 1.2: 1 -0.95,-1.3; 2 0.95,-1.3; 3 0,1.3
SOT-363 = smd 0.42 x 0.7: 1 -0.65,-0.95; 2 0,-0.95; 3 0.65,-0.95; 4 0.65,0.95; 5 0.015,0.95; 6 -0.65,0.95
SOT23-5 = smd 0.55 x 1.2: 1 -0.95,-1.3; 2 0,-1.3; 3 0.95,-1.3; 4 0.95,1.3; 5 -0.95,1.3
MS5611 = smd 1.5 x 0.6: 1 -1.3,1.875; 2 -1.3,0.625; 3 -1.3,-0.625; 4 -1.3,-1.875; 5 1.3,-1.875; 6 1.3,-0.625; 7 1.3,0.625; 8 1.3,1.875
MPU-3X3 = smd 0.5 x 0.2: 1 -1.45,1; 2 -1.45,0.6; 3 -1.45,0.2; 4 -1.45,-0.2; 5 -1.45,-0.6; 6 -1.45,-1; 13 1.45,-1; 14 1.45,-0.6; 15 1.45,-0.2; 16 1.45,0.2; 17 1.45,0.6; 18 1.45,1 | smd 0.2 x 0.5: 7 -1,-1.45; 8 -0.6,-1.45; 9 -0.2,-1.45; 10 0.2,-1.45; 11 0.6,-1.45; 12 1,-1.45; 19 1,1.45; 20 0.6,1.45; 21 0.2,1.45; 22 -0.2,1.45; 23 -0.6,1.45; 24 -1,1.45
OSCILLATOR-5.0X3.2A = smd 1.7 x 1.4: 1 -2,-1.3; 2 2,-1.3; 3 2,1.3; 4 -2,1.3

### Placement (x,y rotation side)
AXIS3D1  28.57,26.04 0 top
AXIS3D2  28.57,31.75 0 top
C1  6.99,29.21 270 bottom
C2  17.78,29.84 180 bottom
C3  27.94,29.84 180 bottom
C4  22.23,15.88 90 bottom
C5  22.23,21.59 90 bottom
C6  10.79,10.79 0 bottom
C7  20.32,12.06 270 bottom
C8  8.26,12.7 0 bottom
C9  8.89,24.77 90 bottom
C10  24.13,21.59 90 bottom
C11  17.14,27.3 180 top
C12  24.77,20.95 90 top
C13  25.4,36.2 180 top
C14  17.14,25.4 180 top
C15  19.68,17.78 180 top
C16  22.86,17.78 0 top
C17  22.86,32.38 90 top
C18  9.53,40.64 180 top
C19  19.68,34.92 0 top
C20  16.51,32.38 90 top
FB1  17.14,29.21 180 top
FB2  26.67,20.95 90 top
L1  25.4,32.38 270 top
LED1  3.81,8.89 270 top
LED2  3.81,7.62 270 top
LED3  3.81,11.43 270 top
LED4  3.81,10.16 270 top
MP1  2.5,2.5 0 top
MP2  40.5,2.5 0 top
MP3  2.5,40.5 0 top
MP4  40.5,40.5 0 top
P1  38.5,29.5 270 top
P2  38.5,13.5 270 top
P3  21.5,4.5 180 top
P4  4.5,18.5 90 top
P5  16.5,38.5 0 top
P6  16.5,38.5 0 bottom
P7  26.5,38.5 0 top
P8  26.5,38.5 0 bottom
P9  27,26 90 bottom
P10  32.75,4.5 180 top
P11  10.25,4.5 180 top
R1  19.68,7.62 0 top
R2  3.81,8.89 180 bottom
R3  3.81,7.62 180 bottom
R4  17.78,36.2 180 bottom
R5  27.94,36.2 180 bottom
R6  3.81,11.43 180 bottom
R7  3.81,10.16 180 bottom
R8  30.48,18.41 180 top
R9  34.29,7.62 270 top
R10  11.43,7.62 270 top
R11  30.48,20.95 180 top
R12  6.99,20.95 270 bottom
R13  9.53,33.02 270 top
REF1  4.95,27.8 0 top
REF2  34.92,40.64 0 top
REF3  9.53,3.17 0 bottom
REF4  36.83,36.83 0 bottom
U1  34.92,29.21 270 top
U2  34.92,13.97 270 top
U3  14.61,18.41 270 bottom
U4  17.78,33.02 0 bottom
U5  27.94,33.02 0 bottom
U6  22.86,7.62 180 top
U7  1.27,20.95 180 top
U8  14.61,33.02 180 bottom
U9  24.77,33.02 180 bottom
U10  34.92,20.95 270 top
U11  31.75,7.62 180 top
U12  8.89,7.62 180 top
U13  6.35,37.47 90 top
U14  19.68,32.38 90 top
U15  15.24,21.59 270 top
U16  9.53,37.47 0 top
U17  21.5,21.5 0 top
XTAL1  10.79,28.57 180 bottom

### Tracks (layer width: path | path; a pad name or v marks a point on that pad's centre or on a via)
3.3V  (via drill 0.2)
  Top 0.203: v30.48,22.71 30.28,22.71 29.77,22.2 R11.5 29.69,22.15 29.69,21.44 R11.6 29.69,21.34 29.69,20.65 R11.7 29.69,20.55 29.69,19.76 R11.8 29.64,19.68 29.64,18.41 R8.2 29.57,18.34 29.57,16.41 26.77,13.61 22.76,13.61 22.73,13.59 v20.4,13.59 | v25.68,21.59 FB2.2 | 20.88,19.53 20.88,18.85 20.34,18.31 | 20.88,19.53 20.88,20.04 U17.8 | 20.34,18.31 20.34,17.78 C15.1 20.42,17.78 v21.39,17.78 | U17.1 20.04,22.48 19.74,22.48 19.53,22.28 19.53,20.32 20.32,19.53 20.8,19.53 20.88,19.53 | v17.6,17.98 18.06,17.98 18.57,18.49 20.14,18.49 20.27,18.36 20.34,18.31 | R13.3 9.14,32.23 9.91,32.23 R13.4 | 5.87,36.35 6.99,37.47 U13.2 | 5.87,36.35 4.93,36.35 4.78,36.5 4.78,37.8 5.08,38.1 5.38,38.1 U13.4 | R13.3 9.12,32.33 9.12,32.51 5.92,35.71 5.92,36.27 5.87,36.35 | U14.5 18.36,31.45 16.59,31.45 C20.1 FB1.2 16.56,29.13 16.56,28.42 v16.76,28.22 | 7.38,18.12 8.15,18.9 8.15,19.84 7.26,20.73 7.26,21.69 v7.82,22.25 | 7.38,18.12 7.21,17.96 5.82,17.96 5.28,18.49 4.52,18.49 P4.1 | v7.98,31.04 9.07,32.13 R13.3 | v10.79,14.71 7.44,18.06 7.38,18.12
  Bottom 0.203: v30.48,22.71 32.82,20.37 P9.4 | 23.67,20.95 24.13,20.95 C10.1 24.21,21.01 24.79,21.59 v25.68,21.59 | 23.67,20.95 22.23,20.95 C5.1 22.15,21.01 22,21.16 20.32,21.16 U3.19 | 20.32,13.59 20.32,14.66 U3.32 20.22,14.71 19.63,14.71 17.6,16.74 v17.6,17.98 17.53,18.03 15.98,18.03 15.49,18.52 15.49,19.36 20.6,24.46 20.6,25.98 19.84,26.75 17.12,26.75 17.04,26.67 16.97,26.62 | 20.32,13.59 20.32,12.72 C7.1 | v20.4,13.59 20.32,13.59 | R6.2 4.47,10.24 R7.2 4.47,8.97 R2.2 R3.2 4.55,8 5.77,8 6.07,8.31 6.07,12.34 7.14,13.41 8.08,13.41 8.74,12.75 8.81,12.75 C8.1 10.85,12.7 U3.48 10.79,12.8 v10.79,14.71 | 10.21,24.13 10.85,24.13 U3.1 10.9,24.03 10.9,23.44 13.39,20.95 16.1,20.95 16.84,21.69 16.84,24.11 U3.13 16.89,24.21 16.89,24.77 16.97,24.84 16.97,26.62 | 10.21,24.13 C9.1 8.81,24.05 8.59,24.05 8.08,23.55 8.08,23.04 8.34,22.77 | 8.34,22.77 8.89,22.23 8.89,22.17 U3.64 | v7.82,22.25 8.28,22.71 8.34,22.77 | v16.76,28.22 16.76,26.82 16.97,26.62 | 10.21,24.13 10.21,24.21 10.21,26.36 9.32,27.25 8.89,27.25 XTAL1.4 8.79,27.94 6.99,29.74 6.99,29.84 C1.1 7.04,29.95 7.04,30.05 7.98,30.99 v7.98,31.04 | v21.39,17.78 21.89,17.78 23.67,19.56 23.67,20.88 23.67,20.95
5.0V  (via drill 0.2)
  Top 0.203: v16.48,37.21 16.48,37.85 17.12,38.48 P5.3 17.17,38.58 17.17,38.91 17.93,39.67 23.82,39.67 | L1.1 26.04,34.62 26.04,36.2 C13.1 26.14,36.25 27.74,36.25 28.98,37.49 | L1.1 | v26.9,30.79 26.9,32.41 25.43,33.88 L1.1 | 28.98,37.49 28.98,39.52 28.83,39.67 27.94,39.67 27.13,38.86 P7.3 27.08,38.94 26.34,39.67 23.82,39.67 | v23.82,39.6 23.82,39.67 | 19.63,3.02 31.01,3.02 32.11,4.12 32.11,4.5 P10.3 32.18,4.06 32.92,3.33 35.08,3.33 39.67,7.92 39.67,9.58 38.89,10.36 38.51,10.36 P2.7 38.94,10.44 41.15,12.65 41.15,15.95 41,16.1 v41,17.68 | 19.63,3.02 10.72,3.02 9.63,4.12 P11.3 | v19.63,5.87 19.63,4.52 P3.5 | v19.63,2.82 19.63,2.95 19.63,3.02 | v39.52,21.87 39.67,22.02 39.67,25.58 38.89,26.36 38.51,26.36 P1.7 | v41,24.16 41,33.45 37.01,37.44 29.06,37.44 28.98,37.49
  Bottom 0.203: C2.1 17.14,29.84 17.14,31.04 17.45,31.34 17.45,31.8 U4.3 17.5,31.9 17.5,32.33 18.52,33.35 20.14,33.35 23.24,36.45 23.24,38.73 23.96,39.46 | 23.96,39.46 24.18,39.67 25.07,39.67 25.86,38.89 25.86,38.51 P8.3 | v16.48,37.21 15.88,37.82 15.88,38.48 P6.3 | 27.3,30.79 27.3,31.04 27.61,31.34 27.61,31.8 U5.3 | 27.3,30.79 27.3,29.84 C3.1 | v26.9,30.79 27.23,30.79 27.3,30.79 | v23.82,39.6 23.9,39.52 23.96,39.46 | v19.63,2.82 v19.63,5.87 | v41,17.68 41,20.4 v39.52,21.87 39.57,21.95 41,23.37 v41,24.16
BOOT0  (via drill 0.2)
  Top 0.203: U6.1 23.88,8.05 23.88,7.19 U6.10 23.95,7.11 23.95,6.38 | 23.95,6.38 23.95,5.54 24.61,4.88 24.61,4.52 P3.1 | v6.07,18.52 v6.07,20.62 | v6.07,16.61 3.89,14.43 3.89,7.11 v4.6,6.4 | v23.9,6.38 23.95,6.38
  Bottom 0.203: U3.60 8.89,20.17 8.28,20.17 8.15,20.3 R12.2 6.91,20.37 6.33,20.37 v6.07,20.62 | v6.07,16.61 v6.07,18.52 | v4.6,6.4 19.36,6.4 19.38,6.43 23.85,6.43 v23.9,6.38
CAN1_H  (via drill 0.2)
  Top 0.152: v23.8,37.67 24.61,38.48 P7.1
  Bottom 0.152: v23.8,37.67 23.8,34.39 U9.1 24.51,34.31 25.4,33.43 27.91,33.43 28.22,33.73 28.22,34.16 U5.7 28.27,34.24 28.27,35.69 28.78,36.2 R5.2 28.73,36.25 28.4,36.58 28.4,38.48 P8.1
CAN1_L  (via drill 0.2)
  Top 0.152: v24.84,37.11 25.86,38.12 25.86,38.48 P7.2
  Bottom 0.152: 27.1,35.18 27.1,36.2 R5.1 | 27.1,35.18 27.61,34.67 27.61,34.24 U5.6 | U9.2 25.73,34.34 25.98,34.34 26.77,35.13 27.05,35.13 27.1,35.18 | v24.84,37.11 24.89,37.11 25.78,36.22 27.03,36.22 R5.1 | P8.2 27.1,38.48 27.1,36.27 R5.1
CAN1_RX  (via drill 0.2)
  Top 0.152: v22,34.39 20.78,35.61 17.55,35.61 15.49,33.55 14.48,33.55 13.31,32.38 v13.31,28.55 | v13.92,25.76 13.92,24.97 13.13,24.18 10.62,24.18 v9.3,22.86
  Bottom 0.152: v22,34.39 22.91,33.48 24.21,33.48 25.86,31.83 U5.4 | v13.31,28.55 13.41,28.55 13.92,28.04 v13.92,25.76 | v9.3,22.86 9.75,22.4 9.75,20.93 9.5,20.68 8.91,20.68 U3.61
CAN1_TX  (via drill 0.2)
  Top 0.152: v25.55,32.89 24.26,32.89 21.23,35.92 17.09,35.92 v16.31,35.13 | v14.88,28.6 14.88,25.5 13.26,23.88 11.07,23.88 8.18,20.98 v7.82,20.98
  Bottom 0.152: v25.55,32.89 28.27,32.89 28.91,32.26 28.91,31.83 U5.1 | v16.31,35.13 16.31,31.37 14.61,29.67 14.61,28.88 v14.88,28.6 | v7.82,20.98 8.13,20.98 8.31,21.16 8.89,21.16 U3.62
CAN2_H  (via drill 0.2)
  Top 0.152: v13.72,38.51 14.61,38.51 P5.1
  Bottom 0.152: U4.7 18.11,34.24 18.11,35.69 18.62,36.2 R4.2 18.57,36.25 18.57,38.25 18.39,38.43 P6.1 18.36,38.51 18.36,38.84 17.55,39.65 14.2,39.65 13.66,39.12 13.66,38.51 | 13.66,38.51 13.66,34.34 U8.1 | v13.72,38.51 13.66,38.51
CAN2_L  (via drill 0.2)
  Top 0.152: v15.88,36.73 15.88,38.48 P5.2
  Bottom 0.152: U4.6 17.45,34.24 17.45,35.69 16.94,36.2 R4.1 | U8.2 15.57,34.34 15.57,35.15 16.59,36.17 16.87,36.17 R4.1 | v15.88,36.73 16.46,36.14 R4.1 | P6.2 17.12,38.48 17.12,36.37 16.99,36.25 R4.1
CAN2_RX  (via drill 0.2)
  Top 0.152: v15.14,29.44 14.96,29.44 11.1,25.58 v6.99,25.58 | v6.3,24.51 6.63,24.51 6.71,24.59 7.34,24.59 v8.64,23.29 | v12.6,20.32 12.6,19.66 v13.56,18.69
  Bottom 0.152: v15.14,29.44 16.79,31.09 16.79,31.8 U4.4 | v6.99,25.58 6.99,25.25 6.3,24.56 v6.3,24.51 | v8.64,23.29 8.97,23.29 9.07,23.39 9.53,23.39 v12.6,20.32 | v13.56,18.69 13.87,18.69 18.34,14.22 18.34,12.72 U3.33
CAN2_TX  (via drill 0.2)
  Top 0.152: v25.53,23.88 27.36,22.05 27.36,19.1 23.55,15.29 17.98,15.29 v17.25,14.55
  Bottom 0.152: v25.53,23.88 25.53,25.76 19.48,31.8 18.77,31.8 U4.1 | v17.25,14.55 17.35,14.55 17.88,14.02 17.88,12.75 17.86,12.72 U3.34
GND  (via drill 0.2)
  Top 0.203: P11.4 8.36,4.52 7.98,4.9 7.98,7.29 8.13,7.44 8.28,7.44 8.89,8.05 8.89,8.36 U12.2 8.94,8.46 8.94,8.74 9.47,9.27 v9.47,9.6 | U6.GND 22.86,8.36 22.25,8.97 20.37,8.97 | 20.37,8.97 19.56,8.15 19.56,6.6 18.39,5.44 18.39,4.52 P3.6 | 16.51,26.36 C11.2 | 16.51,26.36 C14.2 16.43,25.32 16.43,23.47 15.93,22.96 U15.2 | U15.3 15.85,22.89 U15.2 | 22.78,17.07 19.86,17.07 19.15,17.78 C15.2 18.95,17.73 18.64,17.42 17.35,17.42 17.04,17.73 17.04,18.59 16.56,19.07 16.56,21.61 15.93,22.25 15.93,22.81 U15.2 | 22.78,17.07 23.5,17.78 C16.2 23.44,17.86 23.44,18.41 22.12,19.74 22.12,19.96 U17.11 22.12,20.07 22.12,22.94 U17.20 22.12,23.04 22.12,23.27 22.33,23.47 22.68,23.47 22.94,23.22 22.94,22.5 U17.18 23.04,22.48 23.27,22.48 24.13,21.61 24.77,21.61 C12.2 | v23.14,16.69 22.84,16.99 22.78,17.07 | v20.37,10.59 20.37,9.04 20.37,8.97 | U1.10 35.51,28.73 34.34,28.73 U1.5 34.24,28.65 33.93,28.65 33.76,28.47 | 33.76,28.47 33.76,27.23 34.98,26.01 37.24,26.01 38.1,25.15 38.48,25.15 P1.8 38.56,25.04 38.56,24.84 v39.12,24.28 | U10.5 34.34,20.47 35.51,20.47 U10.10 35.61,20.5 36.22,20.5 36.66,20.94 | 36.66,20.94 36.93,21.21 36.93,22 v36.68,22.25 | P10.4 30.86,4.52 30.84,4.55 30.84,7.29 30.99,7.44 31.14,7.44 31.75,8.05 31.75,8.36 U11.2 31.8,8.46 31.8,11.96 32.73,12.89 | 32.73,12.89 33.3,13.46 34.24,13.46 U2.5 34.34,13.49 35.51,13.49 U2.10 35.61,13.44 36.73,13.44 36.78,13.49 39.5,13.49 39.67,13.66 39.67,18.31 39.5,18.49 39.12,18.49 36.73,20.88 36.66,20.94 | 37.13,9.14 36.47,9.14 32.79,12.83 32.73,12.89 | 37.13,9.14 38.48,9.14 P2.8 | v37.13,9.22 37.13,9.14 | U13.6 5.74,36.83 7.01,38.1 7.29,38.1 U13.3 7.39,38.15 8,38.76 8.56,38.76 U16.5 8.66,38.73 10.16,37.24 10.22,37.17
  Top 0.203: 11.02,37.97 11.02,40.97 10.64,41.35 9.7,41.35 8.99,40.64 C18.2 | 10.22,37.17 9.53,36.47 U16.2 | 10.22,37.17 11.02,37.97 | 25.72,37.05 26.01,37.34 27.58,37.34 28.37,38.12 28.37,38.48 P7.4 | 25.72,37.05 24.87,36.2 24.77,36.2 C13.2 24.66,36.25 24.41,36.25 22.17,38.48 18.39,38.48 P5.4 18.39,38.38 18.39,38.15 16.41,36.17 15.34,36.17 14.5,37.01 | v25.65,37.11 25.72,37.05 | 14.5,37.01 13.59,37.92 11.1,37.92 11.02,37.97 | 5.33,21.54 5,21.54 4.52,21.06 P4.5 4.5,20.95 4.5,19.79 P4.3 | 5.33,21.54 v5.94,21.54 | U7.2 1.27,21.72 1.27,22.81 2.9,24.43 3.66,24.43 4.5,23.6 P4.9 4.55,23.5 5.33,22.71 5.33,21.61 5.33,21.54 | 20.12,32.41 20.95,32.41 U14.2 | 20.12,32.41 18.06,32.41 17.45,33.02 C20.2 16.43,33.02 v14.71,33.02 | 20.32,33.91 C19.2 | 20.12,33.71 20.32,33.91 | 20.12,33.71 20.12,32.49 20.12,32.41 | C17.2 22.86,33.05 22.53,33.05 21.69,33.88 20.4,33.88 20.32,33.91 | v19.89,33.91 20.04,33.76 20.12,33.71 | v14.55,37.06 14.5,37.01 | v30.81,29.21 31.01,29.41 32.23,29.41 33.12,28.52 33.68,28.52 33.76,28.47 | v16.41,26.36 16.43,26.36 16.51,26.36
  Bottom 0.203: 9.53,10.79 C6.2 10.24,10.74 10.31,10.74 11.89,9.17 18.92,9.17 20.3,10.54 v20.37,10.59 20.37,11.33 C7.2 20.32,11.43 21.01,11.43 23.98,14.4 23.98,16.18 23.65,16.51 23.14,16.51 | 9.53,10.79 C8.2 | v9.47,9.6 9.47,10.72 9.53,10.79 | 23.14,16.51 C4.2 22.15,16.59 22.07,16.66 20.32,16.66 U3.28 | v23.14,16.69 23.14,16.59 23.14,16.51 | v36.68,22.25 37.59,22.25 P9.6 38,22.58 38.15,22.58 39.48,23.91 | 39.48,23.91 40.54,24.97 40.54,25.53 P9.GND3 | v39.12,24.28 39.42,23.98 39.48,23.91 | v37.13,9.22 40.31,12.39 41.53,12.39 P9.GND1 | v25.65,37.11 24.64,38.12 24.64,38.48 P8.4 | U3.18 20.32,21.67 21.64,21.67 22.15,22.17 C5.2 C10.2 24.21,22.3 24.77,22.3 26.44,23.98 26.44,28.73 26.77,29.06 26.82,29.13 | 28.57,30.99 28.57,31.04 28.27,31.34 28.27,31.8 U5.2 | 28.57,30.99 28.57,29.84 C3.2 28.5,29.79 27.84,29.13 26.82,29.13 | 29.21,30.99 29.39,31.17 29.39,32.46 28.93,32.92 28.93,34.21 U5.8 | 29.21,30.99 28.65,30.99 28.57,30.99 | 26.82,29.13 24.77,31.19 24.77,31.7 U9.3 24.69,31.77 19.99,31.77 19.13,32.64 18.47,32.64 18.14,32.31 18.14,31.9 U4.2 18.11,31.8 18.11,31.34 18.41,31.04 18.41,29.84 C2.2 18.34,29.79 17.68,29.13 16.87,29.13 16.2,28.47 16.2,28.04 | U3.63 8.89,21.64 8.87,21.61 6.99,21.61 R12.1 6.91,21.54 v5.94,21.54 | 6.99,27.15 C1.2 6.93,28.65 6.93,28.73 6.27,29.39 6.27,30.33 7.54,31.6 11.02,31.6 12.7,29.92 XTAL1.2 | 6.99,27.15 8.71,25.43 8.89,25.43 C9.2 | 6.99,27.15 6.91,27.1 4.52,24.71 4.52,23.6 P4.9 | 16.33,26.36 16.33,27.84 16.2,27.96 16.2,28.04 | 16.33,26.36 16.33,24.13 U3.12 | v19.89,33.91 19.58,34.21 18.77,34.21 U4.8 | XTAL1.2 12.8,29.9 14.61,31.7 U8.3 14.63,31.8 14.63,33.02
  Bottom 0.203: 14.63,33.02 14.63,37.06 | 14.63,37.06 14.63,38.48 P6.4 | v14.71,33.02 14.63,33.02 | 16.2,28.04 16.13,28.04 14.63,28.04 12.85,29.82 XTAL1.2 | v14.55,37.06 14.63,37.06 | v30.81,29.21 30.81,29.36 29.26,30.91 29.21,30.99 | v16.41,26.36 16.33,26.36
  other vias: 33.02,36.2 33.02,32.38 26.04,8.89 22.86,10.79 34.29,24.13 21.59,26.67 8.89,10.79 11.43,19.68 33.02,28.57 15.24,7.62 17.14,5.71
  pour Bottom: 0,43 43,43 43,0 0,0
  pour Top: 0,43 43,43 43,0 0,0
GPIOA_1  (via drill 0.2)
  Top 0.152: U1.4 34.34,29.21 U1.11 35.59,29.23 36.3,29.23 | 36.3,29.23 37.26,29.23 38.15,30.12 38.48,30.12 P1.4 | v17.35,13.79 17.65,13.79 18.85,14.99 24,14.99 v25.7,16.69 | v36.3,29.18 36.3,29.23
  Bottom 0.152: v17.35,13.79 16.87,13.31 16.87,12.72 U3.36 | v25.7,16.69 25.7,19.79 29.92,24 29.92,24.21 34.9,29.18 v36.3,29.18
GPIOA_2  (via drill 0.2)
  Top 0.152: U1.6 34.34,28.22 U1.9 35.59,28.25 36.3,28.25 | 36.3,28.25 37.87,28.25 38.48,28.85 P1.5 | v26.24,18.75 v23.42,15.93 | v36.3,28.22 36.3,28.25
  Bottom 0.152: v23.42,15.93 23.42,14.33 21.21,12.12 19.89,12.12 19.63,11.86 17.63,11.86 17.37,12.12 17.37,12.7 U3.35 | v26.24,18.75 26.24,19.79 29.9,23.44 31.8,23.44 36.3,27.94 v36.3,28.22
GPIOA_3  (via drill 0.2)
  Top 0.152: 34.7,27.71 U1.8 35.59,27.69 38.43,27.69 38.48,27.64 P1.6 | 34.7,27.71 34.34,27.71 U1.7 | v22.48,14.15 22.81,14.15 23.04,14.38 27.05,14.38 28.83,16.15 28.83,20.85 29.03,21.06 29.03,22.55 v30.45,23.98 | v34.7,27.1 34.7,27.66 34.7,27.71
  Bottom 0.152: v22.48,14.15 22.91,14.58 22.91,15.67 22.76,15.82 21.69,15.82 21.54,15.67 20.32,15.67 U3.30 | v30.45,23.98 31.57,23.98 v34.7,27.1
GPIOB_1  (via drill 0.2)
  Top 0.152: U2.4 34.34,13.97 U2.11 35.59,13.95 36.47,13.95 | 36.47,13.95 36.85,13.95 36.91,13.89 38.25,13.89 38.48,14.12 P2.4 | v18.14,19.99 18.14,24 19.33,25.2 22.5,25.2 22.99,25.68 34.9,25.68 v39.52,21.06 | v36.47,13.99 36.47,13.95
  Bottom 0.152: v18.14,19.99 19.46,18.67 U3.24 | v39.52,21.06 39.52,20.65 39.75,20.42 39.75,16.76 37.95,14.96 36.91,14.96 36.47,14.53 v36.47,13.99
GPIOB_2  (via drill 0.2)
  Top 0.152: U2.6 34.34,12.98 U2.9 35.59,12.93 38.43,12.93 38.48,12.88 P2.5 38.56,12.9 39.4,12.9 v40.23,13.74 | v23.37,26.21 29.34,26.21 v31.98,28.85
  Bottom 0.152: v23.37,26.21 23.37,25.53 20.32,22.48 20.32,22.17 U3.17 | v31.98,28.85 33.33,30.2 38.23,30.2 40.11,28.32 40.21,28.32 42.04,26.49 42.04,15.54 v40.23,13.74
GPIOB_3  (via drill 0.2)
  Top 0.152: P2.6 38.48,11.63 38.15,11.63 37.34,12.45 35.59,12.45 U2.8 34.34,12.47 U2.7 34.27,12.5 34.01,12.5 33.6,12.9 v33.55,12.9 | v19.02,24.13 20.45,24.13 21.21,24.89 22.63,24.89 23.11,25.38 34.77,25.38 38.91,21.23 v38.91,19.51
  Bottom 0.152: v19.02,24.13 18.36,24.13 U3.16 | v38.91,19.51 38.91,16.79 38.18,16.05 36.7,16.05 v33.55,12.9
I2C1_SCL  (via drill 0.2)
  Top 0.152: U16.1 8.59,36.14 8.59,35.89 9.12,35.36 9.12,33.83 R13.2 9.07,34.09 v8.36,34.09 | v7.59,19.15 7.59,19.91 6.93,20.57 v6.93,24.05 | v6.99,32.72 v6.99,26.34
  Bottom 0.152: v7.59,19.15 8.89,19.15 U3.58 | v6.93,24.05 6.93,24.77 7.52,25.35 7.52,25.81 v6.99,26.34 | v8.36,34.09 v6.99,32.72
I2C1_SDA  (via drill 0.2)
  Top 0.152: U16.3 10.46,36.14 10.46,35.89 9.93,35.36 9.93,33.83 R13.1 9.96,33.76 10.46,33.25 10.46,31.73 9.65,30.91 v9.65,26.11
  Bottom 0.152: v9.65,26.11 9.65,25.04 9.42,24.82 8.46,24.82 5.41,21.77 5.41,20.52 6.25,19.68 8.89,19.68 U3.59
I2C_!EN  (via drill 0.2)
  Top 0.152: v7.29,35.15 7.29,36.8 U13.1
  Bottom 0.152: v7.29,35.15 7.29,33.78 2.11,28.6 2.11,17.7 5.08,14.73 5.79,14.73 6.02,14.96 8.13,14.96 8.33,15.16 8.89,15.16 U3.50
JTMS_SWCLK  (via drill 0.2)
  Top 0.152: U7.5 1.27,19.91 1.52,19.66 3.12,19.66 P4.4 | v3.79,16.79 v3.79,15.27
  Bottom 0.152: v3.79,15.27 4.62,14.43 5.92,14.43 6.15,14.66 8.89,14.66 U3.49 | v3.79,16.79 2.41,18.16 2.41,18.95 P4.4
JTMS_SWDIO  (via drill 0.2)
  Top 0.152: U7.4 0.79,20.19 0.79,19.91 2.18,18.52 3.23,18.52 P4.2 3.28,18.44 3.28,18.24 3.89,17.63 7.11,17.63 10.95,13.79 v11.35,13.79
  Bottom 0.152: v11.35,13.79 11.84,13.31 11.84,12.72 U3.46
MPU9250_!CS  (via drill 0.2)
  Top 0.152: v22.99,24.05 22.15,24.05 21.31,23.22 21.31,22.96 U17.22 | v19.46,31.06 19.46,31.57 18.95,32.08 17.3,32.08 17.04,32.33 15.98,32.33 15.67,32.03 v15.67,26.01
  Bottom 0.152: v22.99,24.05 22.99,24.71 23.9,25.63 23.9,26.62 v19.46,31.06 | v15.67,26.01 14.38,24.71 14.38,24.13 U3.8
MPU9250_IRQ  (via drill 0.2)
  Top 0.152: v23.11,19.81 22.88,20.05 U17.12
  Bottom 0.152: U3.20 21.12,20.66 22.35,19.43 22.73,19.43 v23.11,19.81
MS5611_!CS  (via drill 0.2)
  Top 0.152: v14.33,21.51 14.33,21.39 13.39,20.45 13.39,20.3 U15.5
  Bottom 0.152: v14.33,21.51 14.83,22.02 14.83,24.11 U3.9
N$1  (via drill 0.2)
  Top 0.152: v2.18,10.16 3.05,10.16 LED4.A
  Bottom 0.152: v2.18,10.16 R7.1
N$2  (via drill 0.2)
  Top 0.152: v2.18,8.89 3.05,8.89 LED1.A
  Bottom 0.152: v2.18,8.89 R2.1
N$3  (via drill 0.2)
  Top 0.152: v2.18,7.62 3.05,7.62 LED2.A
  Bottom 0.152: v2.18,7.62 R3.1
N$4
  Top 0.152: U17.10 21.72,20.04 21.72,18.97 22.2,18.49 C16.1
N$5  (via drill 0.2)
  Top 0.152: v2.18,11.43 3.05,11.43 LED3.A
  Bottom 0.152: v2.18,11.43 R6.1
N$6
  Top 0.152: U17.13 22.96,20.5 24.59,20.5 24.77,20.32 C12.1 24.82,20.32 26.67,20.32 FB2.1
N$7  (via drill 0.2)
  Top 0.152: v12.06,11.63 11.86,11.43 4.57,11.43 LED3.C
  Bottom 0.152: v12.06,11.63 12.06,11.84 12.34,12.12 12.34,12.7 U3.45
N$8
  Bottom 0.152: U3.5 12.85,24.13 12.85,27.2 12.8,27.25 XTAL1.3
N$9
  Top 0.203: 9.45,39.93 8.18,39.93 5.74,37.49 U13.5 | 9.45,39.93 10.16,40.64 C18.1 | U16.4 10.46,38.79 10.46,38.89 9.5,39.85 9.45,39.93
N$11
  Top 0.152: C19.1 19.02,34.92 19.02,33.98 U14.4
N$12  (via drill 0.2)
  Top 0.152: v12.83,11.63 11.35,10.16 4.57,10.16 LED4.C
  Bottom 0.152: v12.83,11.63 12.83,12.68 U3.44
N$13  (via drill 0.2)
  Top 0.152: v7.42,5.84 7.42,7.42 5.74,9.09 5.28,9.09 5.08,8.89 4.57,8.89 LED1.C | v24.43,11.15 v24.43,8.76
  Bottom 0.152: v7.42,5.84 15.85,5.84 19.41,2.29 20.57,2.29 24.43,6.15 v24.43,8.76 | v24.43,11.15 24.43,11.38 23.34,12.47 23.34,13.28 24.31,14.25 24.31,16.33 23.42,17.22 20.37,17.22 20.32,17.17 U3.27
N$14  (via drill 0.2)
  Top 0.152: v5.51,8.56 4.57,7.62 LED2.C | v15.65,16.15 18.21,16.15 v18.92,16.87
  Bottom 0.152: v5.51,8.56 5.51,12.27 7.52,14.28 9.6,14.28 11.48,16.15 v15.65,16.15 | v18.92,16.87 19.71,17.65 U3.26
N$18
  Top 0.152: 21.82,31.73 21.29,31.73 21.01,31.45 U14.1 | 21.82,31.73 C17.1 22.91,31.67 23.77,30.81 25.4,30.81 L1.2 | U14.3 21.01,33.33 21.26,33.33 21.82,32.77 21.82,31.77 21.82,31.73
NRST  (via drill 0.2)
  Top 0.152: P3.2 23.37,4.52 23.37,7.11 U6.9 U6.2 23.34,8.13 23.34,8.46 20.19,11.61 15.14,11.61 13.49,13.26 11.05,13.26 6.99,17.32 2.87,17.32 0.38,19.81 0.38,21.01 0.48,21.11 0.53,21.16 | P4.10 1.78,22.12 1.78,21.72 U7.1 1.75,21.64 1.75,21.41 1.5,21.16 0.53,21.16 | v13.39,25.2 7.37,25.2 7.21,25.04 3.02,25.04 0.38,22.4 0.38,21.31 0.53,21.16
  Bottom 0.152: v13.39,25.2 13.84,24.74 13.84,24.13 U3.7
P_UART1_RX
  Top 0.152: U6.5 U6.6 21.79,7.21 20.5,7.21 R1.3 20.88,7.16 20.88,4.52 P3.4
P_UART1_TX
  Top 0.152: R1.4 20.5,8.03 21.06,8.03 21.67,8.64 22.05,8.64 22.35,8.33 22.35,8.13 U6.4 22.38,8.05 22.38,7.19 U6.7 22.35,7.11 22.35,4.72 22.15,4.52 P3.3
P_UART4_RX
  Top 0.152: 33.35,6.33 33.4,6.33 33.88,6.81 R9.3 | 33.35,6.33 31.52,6.33 31.27,6.58 31.27,6.86 U11.4 | 33.35,6.33 33.35,6.27 33.35,4.52 P10.2
P_UART4_TX
  Top 0.152: U11.5 31.75,6.88 31.75,7.16 32.05,7.47 34.29,7.47 34.67,7.09 34.67,6.83 R9.4 34.67,6.76 34.67,4.55 34.65,4.52 P10.1
P_UART6_RX
  Top 0.152: 10.54,6.33 8.66,6.33 8.41,6.58 8.41,6.86 U12.4 | 10.54,6.33 11.02,6.81 R10.3 | 10.54,6.33 10.59,6.27 10.59,4.8 10.87,4.52 P11.2
P_UART6_TX
  Top 0.152: U12.5 8.89,6.88 8.89,7.16 9.2,7.47 11.43,7.47 11.81,7.09 11.81,6.83 R10.4 11.86,6.76 11.86,4.78 12.12,4.52 P11.1
SDIO_CLK  (via drill 0.2)
  Top 0.152: U10.3 34.34,21.46 35.51,21.46 U10.12 35.59,21.46 v36.37,21.46 | v11.23,16.66 13.06,16.66 17.2,12.52 v25.22,12.52
  Bottom 0.152: v36.37,21.46 P9.5 37.77,21.44 38.3,21.44 39.45,20.3 39.45,16.89 38.3,15.75 37.26,15.75 33.02,11.51 32.54,11.51 31.52,12.52 v25.22,12.52 | v11.23,16.66 U3.53
SDIO_CMD  (via drill 0.2)
  Top 0.152: U10.11 34.34,20.95 U10.4 34.27,20.93 34.01,20.93 33.66,20.57 33.27,20.57 | 33.27,20.57 31.29,20.57 R11.2 | v6.86,16.69 7.19,16.69 11.71,12.17 13.06,12.17 13.41,11.81 13.41,7.87 17.93,3.35 25.07,3.35 29.26,7.54 29.26,14.05 33.27,18.06 33.27,19.28 | 33.27,19.28 33.27,20.52 33.27,20.57 | v33.43,19.28 33.33,19.28 33.27,19.28
  Bottom 0.152: v6.86,16.69 7.32,17.14 8.89,17.14 U3.54 | v33.43,19.28 37.69,19.28 P9.3
SDIO_D0  (via drill 0.2)
  Top 0.152: v16.59,13.89 16.59,13.79 17.32,13.06 v23.88,13.06 | v27.33,16.89 v25.65,15.21 | v30.12,17.45 30.12,17.53 30.53,17.93 30.53,20.85 31.01,21.34 31.22,21.34 R11.3 31.29,21.36 33.45,21.36 34.01,21.92 34.27,21.92 U10.2 34.34,21.97 35.51,21.97 U10.13 35.59,22 35.87,22 36.07,22.2 36.07,22.4 36.37,22.71 v36.37,23.01
  Bottom 0.152: v16.59,13.89 15.95,13.89 15.37,13.31 15.37,12.72 U3.39 | v23.88,13.06 23.88,13.39 25.65,15.16 v25.65,15.21 | v27.33,16.89 29.57,16.89 v30.12,17.45 | v36.37,23.01 37.01,23.65 37.69,23.65 P9.7
SDIO_D1  (via drill 0.2)
  Top 0.152: v14.86,15.62 14.86,17.58 v16.05,18.77 | v21.44,24.36 22.53,24.36 23.24,25.07 30.12,25.07 31.29,23.9 31.29,22.25 R11.4 31.29,22.17 33.76,22.17 34.01,22.43 34.27,22.43 U10.1 34.34,22.45 U10.14 35.53,22.53 35.61,22.61 v35.61,23.06
  Bottom 0.152: v14.86,15.62 14.86,12.72 U3.40 | v16.05,18.77 16.05,19 21.41,24.36 v21.44,24.36 | v35.61,23.06 37.29,24.74 37.69,24.74 P9.8
SDIO_D2  (via drill 0.2)
  Top 0.152: U10.7 34.34,19.46 U10.8 35.53,19.38 35.53,18.24 v36.47,17.3 | v32.44,18.41 31.34,18.41 R8.1 31.29,18.36 31.29,17.65 25.76,12.12 v25.76,10.85 | v5.56,13.66 v5.56,15.27
  Bottom 0.152: P9.1 37.47,17.3 v36.47,17.3 36.42,17.35 34.16,17.35 33.1,18.41 v32.44,18.41 | v5.56,15.27 6.58,15.27 6.96,15.65 8.89,15.65 U3.51 | v5.56,13.66 3.86,11.96 3.86,7.09 4.01,6.93 21.84,6.93 v25.76,10.85
SDIO_D3  (via drill 0.2)
  Top 0.152: U10.6 34.34,19.96 35.51,19.96 U10.9 35.59,19.91 35.87,19.91 36.07,19.71 v36.07,18.47 | R11.1 31.29,19.74 v32.21,19.74 32.26,19.68 32.97,18.97 32.97,18.19 26.31,11.53 v26.31,11.38 | v6.5,15.95 6.5,12.09 v6.63,11.96
  Bottom 0.152: v32.21,19.74 33.78,18.16 36.07,18.16 | 36.07,18.16 37.29,18.16 P9.2 | v36.07,18.47 36.07,18.21 36.07,18.16 | v6.5,15.95 6.71,16.15 8.89,16.15 U3.52 | v6.63,11.96 6.63,11.68 9.47,8.84 22.99,8.84 25.53,11.38 v26.31,11.38
SPI1_MISO  (via drill 0.2)
  Top 0.152: v21.39,18.54 21.31,18.62 U17.9
  Bottom 0.152: v21.39,18.54 21.39,19.15 20.88,19.66 20.32,19.66 U3.22
SPI1_MOSI  (via drill 0.2)
  Top 0.152: v19.2,19.68 19.2,22.43 19.71,22.94 20.5,22.94 U17.24
  Bottom 0.152: v19.2,19.68 19.71,19.18 20.3,19.18 U3.23
SPI1_SCLK  (via drill 0.2)
  Top 0.152: v18.67,20.85 18.67,22.33 19.79,23.44 20.65,23.44 20.88,23.22 20.88,22.96 U17.23
  Bottom 0.152: v18.67,20.85 19.02,20.85 19.71,20.17 U3.21
SPI2_MISO  (via drill 0.2)
  Top 0.152: v15.09,21.51 15.09,20.75 U15.6
  Bottom 0.152: v15.09,21.51 15.34,21.77 15.34,24.11 U3.10
SPI2_MOSI  (via drill 0.2)
  Top 0.152: v15.85,21.51 15.85,20.3 U15.7
  Bottom 0.152: v15.85,21.51 U3.11
SPI2_SCLK  (via drill 0.2)
  Top 0.152: v18.14,19.23 17.09,20.27 U15.8
  Bottom 0.152: v18.14,19.23 18.14,16.89 18.85,16.18 20.3,16.18 U3.29
SPI3_MISO  (via drill 0.2)
  Top 0.152: P1.2 38.48,32.61 38.15,32.61 37.36,31.83 37.36,31.75 35.87,30.25 35.59,30.25 U1.13 35.51,30.23 34.34,30.23 U1.2 34.27,30.25 32.66,30.25 v32.64,30.28 | P2.2 38.48,16.61 37.9,16.61 36.3,15.01 35.59,15.01 U2.13 35.51,14.99 34.34,14.99 U2.2 34.29,14.91 v33.55,14.91 | v19.07,14.45 22.02,14.45 22.25,14.68 26.59,14.68 v26.82,14.91
  Bottom 0.152: v19.07,14.45 18.59,14.45 13.82,19.23 13.34,19.23 12.29,18.19 8.91,18.19 U3.56 | v33.55,14.91 v26.82,14.91 26.77,14.96 26.67,14.96 25.17,16.46 25.17,19.68 29.11,23.62 29.11,26.75 v32.64,30.28
SPI3_MOSI  (via drill 0.2)
  Top 0.152: U1.1 34.34,30.71 U1.14 35.53,30.79 35.53,31.24 36.75,32.46 | 36.75,32.46 38.15,33.86 38.48,33.86 P1.1 | P2.1 38.48,17.86 38.15,17.86 35.79,15.49 35.59,15.49 U2.14 34.34,15.47 U2.1 34.27,15.44 33.33,15.44 v29.79,11.91 | v9.98,18.72 9.98,17.14 13.56,13.56 15.72,13.56 17.37,11.91 v24.66,11.91 | v36.8,32.38 36.8,32.41 36.75,32.46 | v40.34,28.85 40.34,28.52 40.46,28.4 40.46,15.82 v40.59,15.7
  Bottom 0.152: v9.98,18.72 9.93,18.67 U3.57 | v24.66,11.91 v29.79,11.91 29.84,11.86 30.5,11.2 35.71,11.2 40.21,15.7 v40.59,15.7 | v40.34,28.85 v36.8,32.38
SPI3_SCLK  (via drill 0.2)
  Top 0.152: U2.3 34.34,14.48 U2.12 35.59,14.5 36.22,14.5 36.65,14.94 | 36.65,14.94 37.08,15.37 38.48,15.37 P2.3 | P1.3 38.48,31.37 38.15,31.37 36.52,29.74 35.59,29.74 U1.12 34.34,29.72 U1.3 34.27,29.74 33.55,29.74 | v14.73,19.07 v13.34,17.68 | v20.04,25.73 22.12,25.73 25.63,29.23 30.07,29.23 30.58,29.74 33.55,29.74 | v37.13,14.43 37.13,14.45 36.7,14.88 36.65,14.94 | v33.55,29.67 33.55,29.69 33.55,29.74
  Bottom 0.152: v13.34,17.68 8.91,17.68 U3.55 | v14.73,19.07 20.04,24.38 v20.04,25.73 | v37.13,14.43 38.51,14.43 41.73,17.65 41.73,26.36 40.08,28.02 38.23,28.02 36.52,29.72 33.6,29.72 v33.55,29.67
UART1_RX  (via drill 0.2)
  Top 0.152: v13.95,11.28 17.98,7.24 18.87,7.24 R1.2
  Bottom 0.152: v13.95,11.28 13.95,11.56 13.36,12.14 U3.43
UART1_TX  (via drill 0.2)
  Top 0.152: v14.71,11.28 17.96,8.03 R1.1
  Bottom 0.152: v14.71,11.28 13.87,12.12 U3.42
UART4_RX  (via drill 0.2)
  Top 0.152: v32.77,12.04 33.88,10.92 33.88,8.43 R9.2 | v28.5,21.29 28.5,24.46 v28.57,24.54 | v29.41,29.77 27.08,29.77 26.85,29.54 22.73,29.54 v18.62,25.43
  Bottom 0.152: v32.77,12.04 32.77,13.36 34.09,14.68 34.09,15.7 v28.5,21.29 | v28.57,24.54 28.57,28.7 29.41,29.54 v29.41,29.77 | v18.62,25.43 18.16,24.97 18.14,24.97 17.86,24.69 17.86,24.13 U3.15
UART4_TX  (via drill 0.2)
  Top 0.152: v34.7,9.42 34.7,8.43 R9.1 | v40.23,14.96 40.23,15.29 40.06,15.47 40.06,28.37 39.65,28.78 39.65,34.31 39.5,34.47 31.34,34.47 26.72,29.84 22.28,29.84 v18.62,26.19
  Bottom 0.152: v40.23,14.96 v34.7,9.42 | v18.62,26.19 17.37,24.94 17.37,24.13 U3.14
UART6_RX  (via drill 0.2)
  Top 0.152: v12.88,10.52 11.05,8.69 11.05,8.43 R10.2
  Bottom 0.152: v12.88,10.52 14.71,10.52 15.85,11.66 U3.38
UART6_TX  (via drill 0.2)
  Top 0.152: v12.88,9.73 11.84,8.69 11.84,8.43 R10.1
  Bottom 0.152: v12.88,9.73 14.35,9.73 16.33,11.71 16.33,12.7 U3.37
VCAP_1
  Bottom 0.203: C4.1 20.34,15.21 20.32,15.19 U3.31
VCAP_2
  Bottom 0.203: C6.1 11.43,10.79 11.43,12.65 11.38,12.7 U3.47
VDD_PRES
  Top 0.152: FB1.1 17.8,29.21 17.8,27.36 C11.1 17.8,27.3 17.8,25.4 C14.1 17.75,25.35 17.12,24.71 17.12,22.91 U15.1

### Text on the board
tPlace: 2 | 1 | 2014.09.28 | AUTOPILOT-v1 | ACCL / GYRO | MAGN | A | A | B | C | B | D | 6 | 1 | 4
bPlace: 2 | 1
Reference: Ref. (0,0)